# EAGLE design untitled (EAGLE 9.3.0)
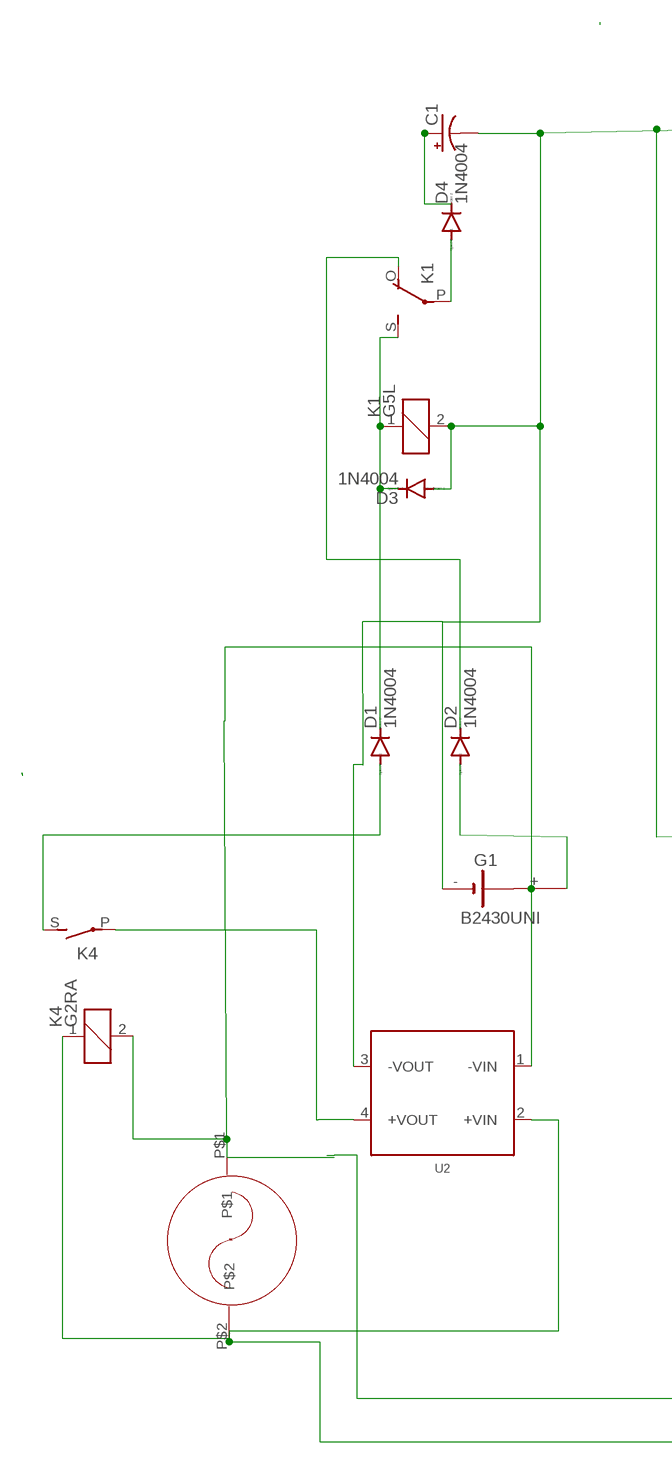
[diagram p0: schematic, sheet 1, part 1 of 2]
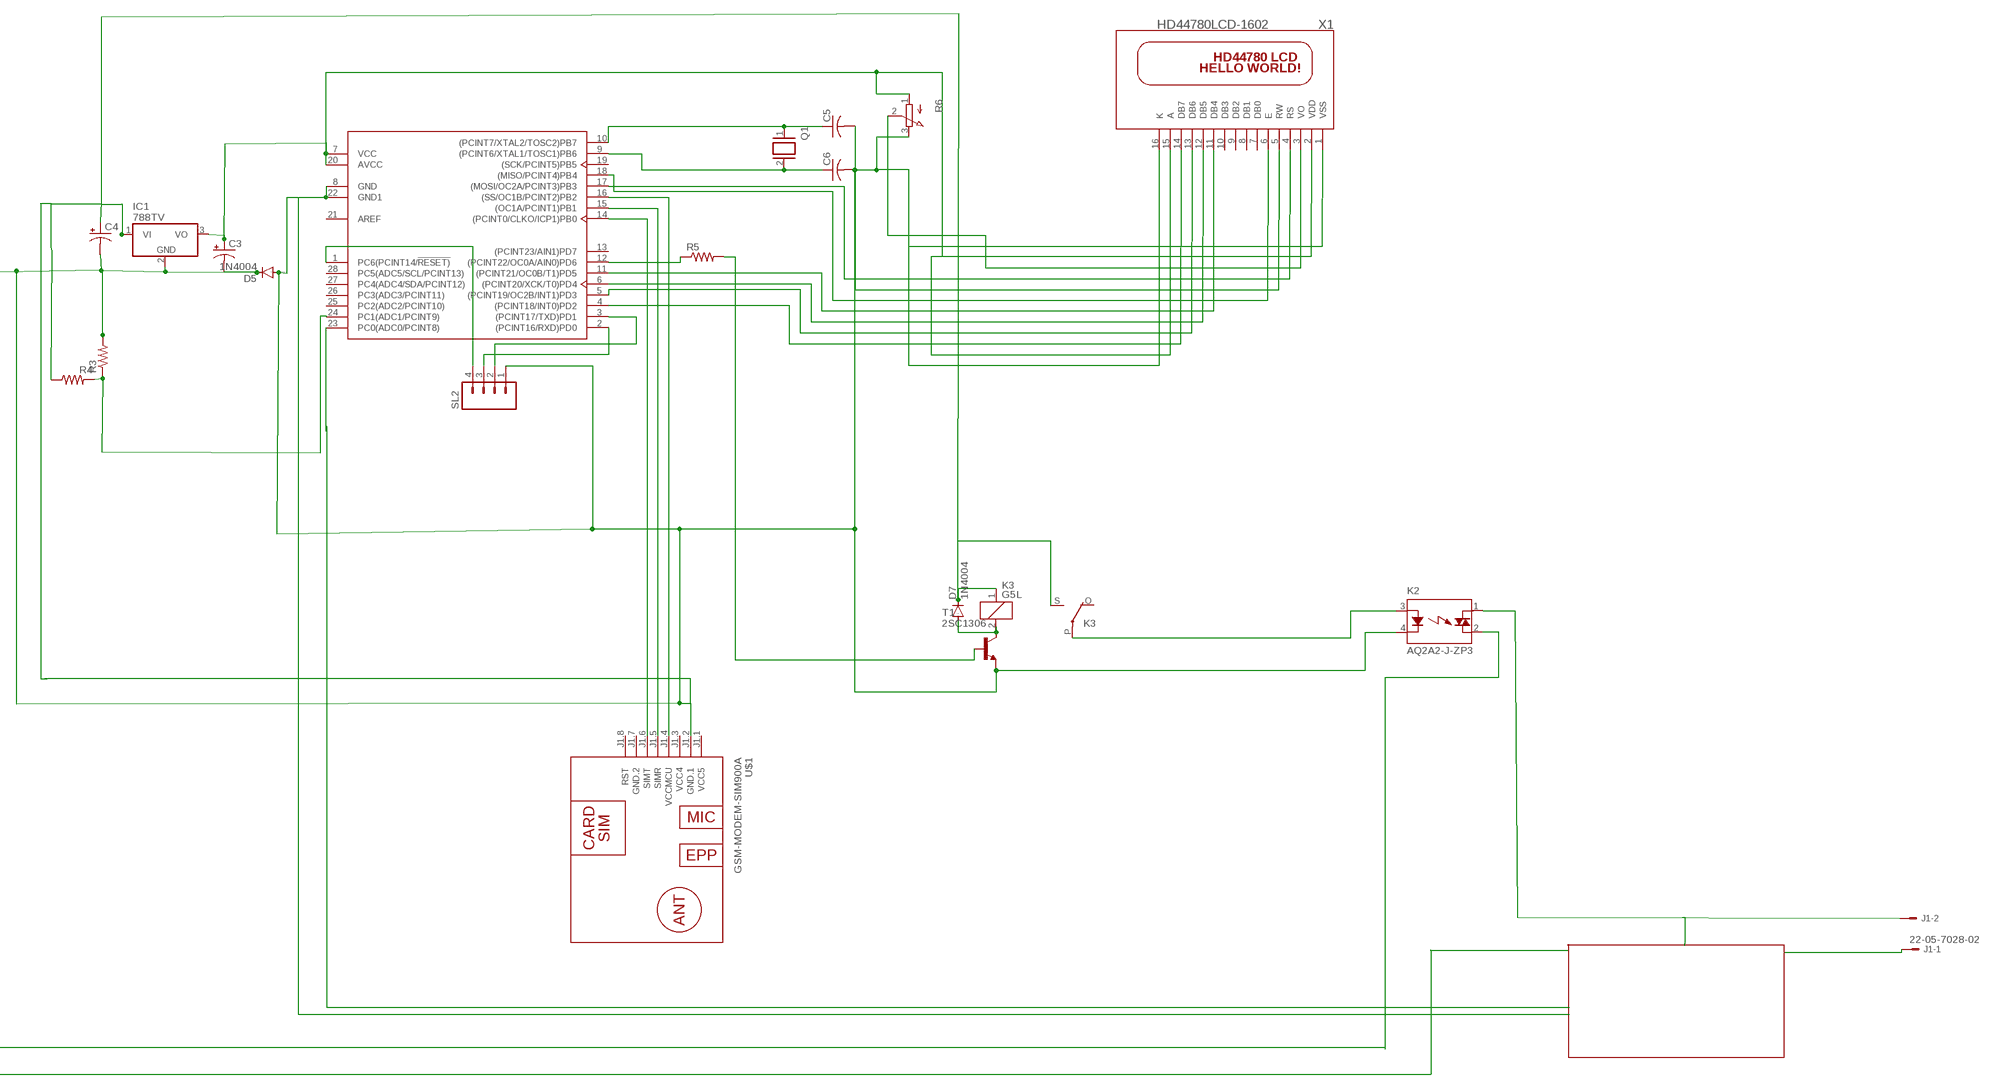
[diagram p1: schematic, sheet 1, part 2 of 2]

## Parts
C1  CPOL-USE10-20  [EB20D]
C3  CPOL-USE2-5  [E2-5]
C4  CPOL-USE5-8.5  [E5-8,5]
C5  C-US025-025X050  [C025-025X050]
C6  C-US025-025X050  [C025-025X050]
D1  1N4004  [DO41-10]
D2  1N4004  [DO41-10]
D3  1N4004  [DO41-10]
D4  1N4004  [DO41-10]
D5  1N4004  [DO41-10]
D7  1N4004  [DO41-10]
G1  B2430UNI  [B2430UNI]
IC1  788TV  [TO220V]
J1  22-05-7028-02  [7395-02]
K1  G5L  [G5LE]
K2  AQ2A2-J-ZP3  [AQ1-FLAT]
K3  G5L  [G5LE]
K4  G2RA  [G2RA]
Q1  XTAL  [Q]
R3  R-US_0207/7  [0207/7]
R4  R-US_0207/7  [0207/7]
R5  R-US_0207/7  [0207/7]
R6  3RP/1610N  [3RP/1610N]
SL2  M04  [04P]
T1  2SC1306  [TO220BV]
U1  ATMEGA328P-PU  [DIP-28]
U2  MAGI³C-FISM_SIP-4_177920501  [MAGI³C-FISM_SIP-4]
U$1  GSM-MODEM-SIM900A  [GSM-MODEM-SIM900A]
U$2  AC230.  [AC230]  (not placed on a sheet)
U$3  AC230.  [AC230]  (not placed on a sheet)
U$4  AC230.  [AC230]  (not placed on a sheet)
U$5  AC230.  [AC230]  (not placed on a sheet)
U$6  AC230.  [AC230]  (not placed on a sheet)
U$7  AC230.  [AC230]  (not placed on a sheet)
U$8  AC230.  [AC230]  (not placed on a sheet)
U$9  AC230.  [AC230]  (not placed on a sheet)
U$10  AC230.  [AC230]  (not placed on a sheet)
U$11  AC230.  [AC230]  (not placed on a sheet)
U$12  AC230.  [AC230]  (not placed on a sheet)
U$13  AC230.  [AC230]
X1  HD44780LCD-1602  [LCD1602]

## Nets
N$1: D1.A K4.S(2:S)
N$2: C4.+
N$3: D2.A G1.+
N$4: D2.C K1.O(2:O)
N$5: D1.C D3.C K1.1 K1.S(2:S)
N$6: D4.A K1.P(2:P)
N$7: R5.1 U1.12((PCINT22/OC0A/AIN0)PD6)
N$8: C1.- C3.- C4.- D3.A D5.C G1.- IC1.2(GND) K1.2
N$9: U2.3(-VOUT)
N$10: C6.1 Q1.2 U1.9((PCINT6/XTAL1/TOSC1)PB6)
N$11: C5.1 Q1.1 U1.10((PCINT7/XTAL2/TOSC2)PB7)
N$12: G1.+@2(+) K4.2 U2.1(-VIN) U$13.P$1
N$13: K2.2(DS2)
N$14: U1.11((PCINT21/OC0B/T1)PD5) X1.11(DB4)
N$15: R6.2(S) X1.3(VO)
N$16: U1.17((MOSI/OC2A/PCINT3)PB3) X1.4(RS)
N$17: U1.18((MISO/PCINT4)PB4) X1.6(E)
N$18: U1.6((PCINT20/XCK/T0)PD4) X1.12(DB5)
N$19: U1.5((PCINT19/OC2B/INT1)PD3) X1.13(DB6)
N$20: U1.4((PCINT18/INT0)PD2) X1.14(DB7)
N$21: U1.23(PC0(ADC0/PCINT8))
N$22: K3.S(2:S)
N$23: K2.3(A) K3.P(2:P)
N$24: R3.1 R4.2 U1.24(PC1(ADC1/PCINT9))
N$26: J1.2 K2.1(DS1)
N$28: J1.1
N$31: R5.2 T1.1(B)
N$32: D7.A K3.2 T1.2(C)
N$33: SL2.4 U1.1(PC6(PCINT14/!RESET))
N$34: SL2.3 U1.2((PCINT16/RXD)PD0)
N$35: SL2.2 U1.3((PCINT17/TXD)PD1)
N$36: U1.14((PCINT0/CLKO/ICP1)PB0) U$1.J1.6(SIMT)
N$37: U1.15((OC1A/PCINT1)PB1) U$1.J1.5(SIMR)
N$38: U1.16((SS/OC1B/PCINT2)PB2) U$1.J1.4(VCCMCU)
N$40: IC1.1(VI)
N$42: R3.2
N$150: D7.C K3.1
N$152: C1.+ D4.C
N$154: R4.1
N$158: K4.P(2:P) U2.4(+VOUT)
N$159: K4.1 U2.2(+VIN) U$13.P$2
VDD: C3.+ IC1.3(VO) R6.1(A) U1.7(VCC) U1.20(AVCC) X1.2(VDD) X1.15(A)
VSS: C5.2 C6.2 D5.A K2.4(K) R6.3(E) SL2.1 T1.3(E) U1.8(GND) U1.22(GND1) U$1.J1.2(GND.1) X1.1(VSS) X1.5(RW) X1.16(K)
Unconnected: G1.+@1(+) G1.+@3(+) G1.+@4(+) G1.-@1(-) K3.O(2:O) U1.13((PCINT23/AIN1)PD7) U1.19((SCK/PCINT5)PB5) U1.21(AREF) U1.25(PC2(ADC2/PCINT10)) U1.26(PC3(ADC3/PCINT11)) U1.27(PC4(ADC4/SDA/PCINT12)) U1.28(PC5(ADC5/SCL/PCINT13)) U$1.J1.8(RST) U$2.P$1 U$2.P$2 U$3.P$1 U$3.P$2 U$4.P$1 U$4.P$2 U$5.P$1 U$5.P$2 U$6.P$1 U$6.P$2 U$7.P$1 U$7.P$2 U$8.P$1 U$8.P$2 U$9.P$1 U$9.P$2 U$10.P$1 U$10.P$2 U$11.P$1 U$11.P$2 U$12.P$1 U$12.P$2 X1.7(DB0) X1.8(DB1) X1.9(DB2) X1.10(DB3)

## Power pins joined to a net without a drawn wire
GND.2: U$1.J1.7(GND.2)
VCC4: U$1.J1.3(VCC4)
VCC5: U$1.J1.1(VCC5)

## Library data of the parts
C1 C3 C4 = adafruit:CPOL-US: POLARIZED CAPACITOR, American symbol
C5 C6 = adafruit:C-US: CAPACITOR, American symbol
D1-D5 D7 = diode:1N4004: DIODE general purpose rectifier, 1 A
G1 = battery:B2430UNI: LI BATTERY
IC1 = linear:78*: Positive VOLTAGE REGULATOR Source: http://cache.national.com/ds/LM/LM78L05.pdf http://www.fairchildsemi.com/ds/LM/LM7805.pdf
J1 = con-molex:22-?-02: CONNECTOR wire to board 2.54 mm (.1 inch) pitch header; MF: MOLEX; OC_FARNELL: 9731601; OC_NEWARK: unknown
K1 K3 = relay:G5L: RELAY 1 x switch, 10 A/120 V AC, 8 A/30 V ADC, Omron; OC_FARNELL: unknown; OC_NEWARK: unknown
K2 = relay:AQ?: SOLID STATE RELAY NAiS Source: http://www.mew-europe.com/.. en_ds_61601_0000.pdf; MPN: AQ2A2-ZP3/28VDC; OC_FARNELL: 1163552; OC_NEWARK: 13P1232
K4 = relay:G2RA: RELAY 1 x norm. open, Omron; OC_FARNELL: unknown; OC_NEWARK: unknown
Q1 = special:XTAL: CRYSTAL
R3-R5 = adafruit:R-US_: RESISTOR, American symbol
R6 = pot:3RP/1610N: 16mm Potentiometer one level Source: http://www.alphapotentiometers.net/html/16mm_pot_2.html
SL2 = con-amp-quick:M04: AMP QUICK CONNECTOR; OC_FARNELL: unknown; OC_NEWARK: unknown
T1 = transistor:2SC1306: NPN Transistor Final RF Power Outupt Source: 2sc1306.pdf
U1 = Microcontroller:ATMEGA328P-PU: IC MCU 8BIT 32KB FLASH 28DIP Manufacturer's datasheet <http://ww1.microchip.com/downloads/en/DeviceDoc/ATmega48A-PA-88A-PA-168A-PA-328-P-DS-DS40002061A.pdf>; CREATED_BY: PCBLayout.com; DIGIKEY_PART_NUMBER: ATMEGA328P-PU-ND; MANUFACTURER: Microchip Technology; MPN: ATMEGA328P-PU; PACKAGE: DIP-28
U2 = Wurth_Isolated Converter_MagI³C-FISM:MAGI³C-FISM_SIP-4: MagI³C-FISM Fixed Isolated Module Characteristics Simplest design (no transformer design know how required) Leaded through-hole package for easy manufacturing and prototyping Stand alone solution (CIN and COUT integrated, no external components) Simple functional isolation for overvoltage protection, avoiding ground loops, ground shift and noise in signal path or sensor systems Industrial standard package and pin configuration Low conducted and radiated EMI (compliant to EN55022 class B) UL60950 certified Applications Data acquisition Test and measurement systems Interface and microcontroller supply Industrial control <https://katalog.we-online.com/media/images/v2/o84919v209%20Family_WE-FISM.jpg> Details see: https://katalog.we-online.com/en/pm/MAGIC-FISM Updated by Ella, Wu 2019-09-19 2019 (C) Wurth Elektronik; DATASHEET-URL: https://katalog.we-online.com/pm/datasheet/177920501.pdf; MOUNT: THT; PART-NUMBER: 177920501; V-INPUT: 2.97-3.63V; V-OUTPUT: 5V; VISO: 1kV; W-OUTPUT: 1W
U$1 = diy-modules:GSM-MODEM-SIM900A: GSM Mini Module based on SIM900A Schematic available here: http://www.electrodragon.com/w/SIM900_(SIM900A)_Mini_DEV_Board
U$2-U$13 = AC230:AC230.
X1 = adafruit:HD44780LCD: HD44780 LCD Standard character type LCDs, available in sizes from 8x1 to 40x4!

## Board
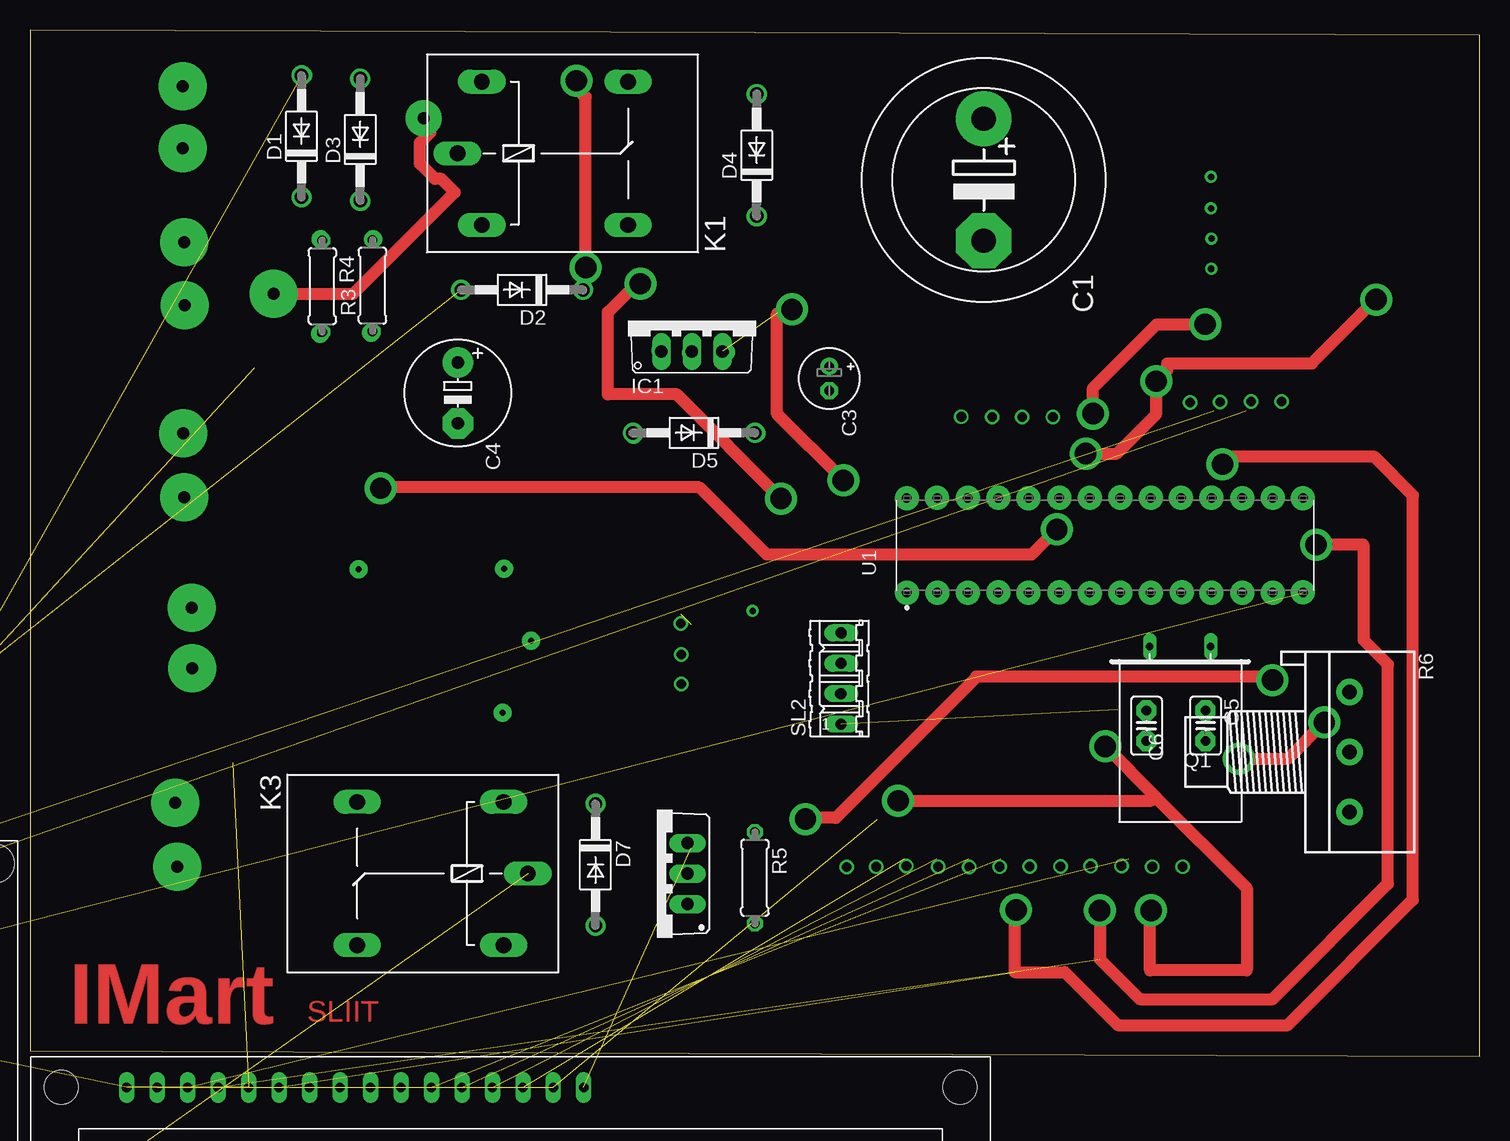
[diagram p2: board, top side]
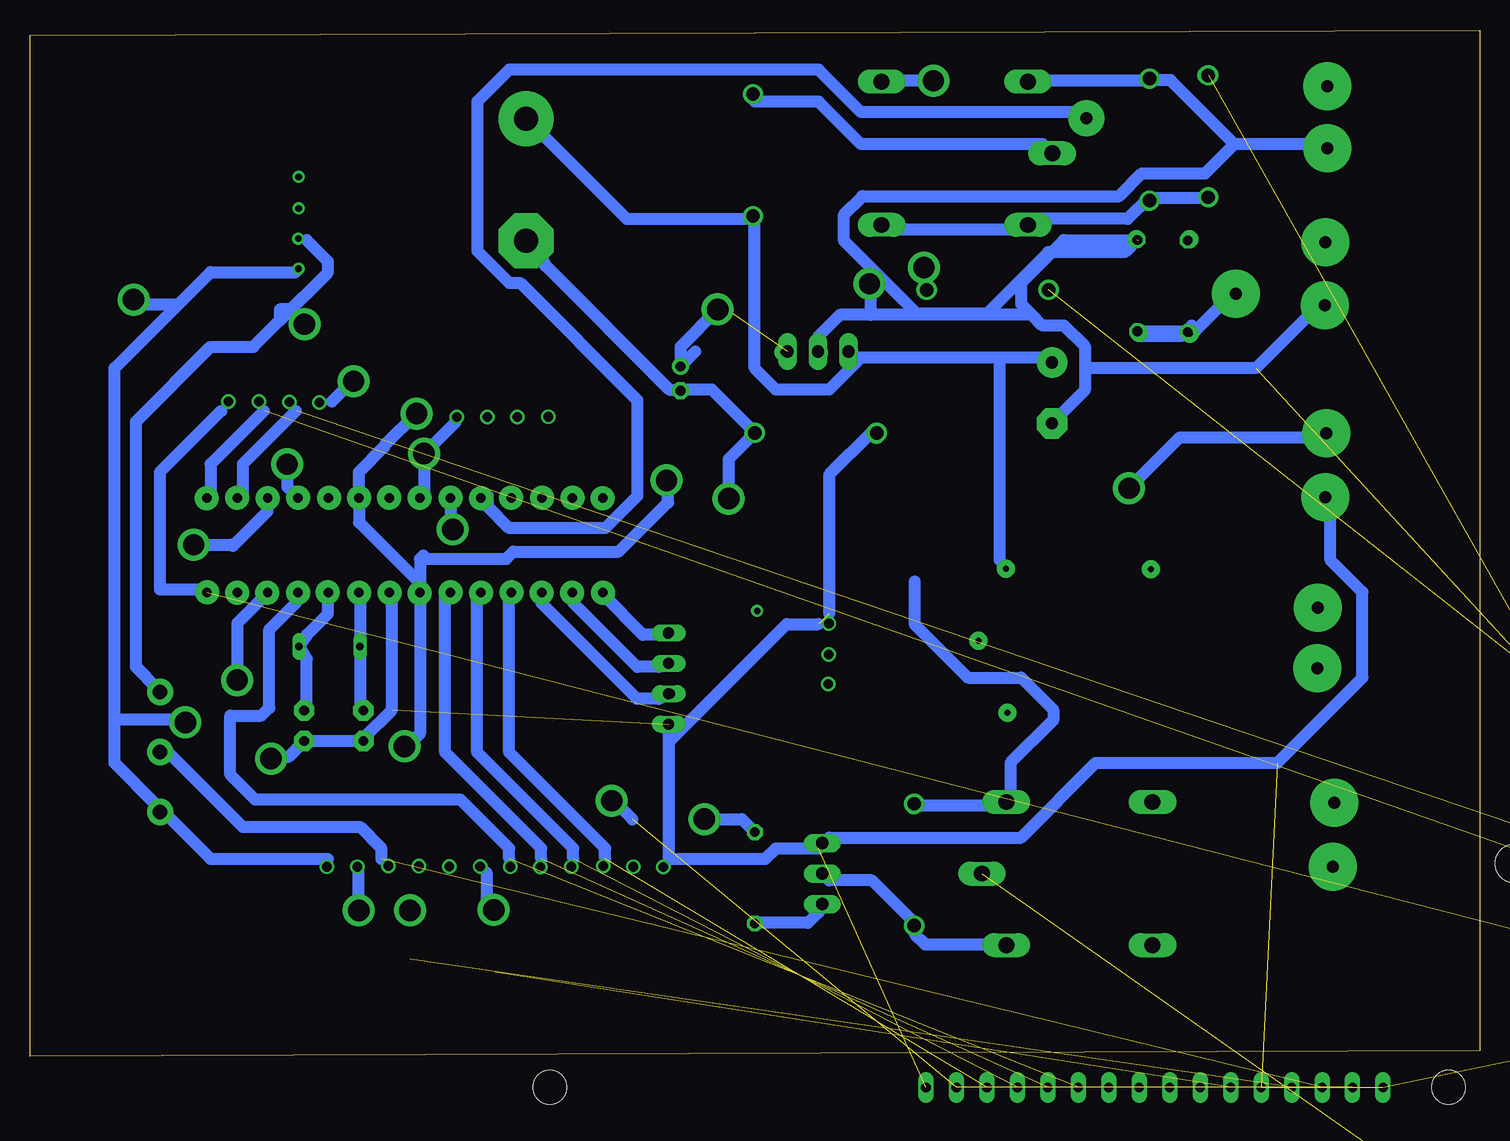
[diagram p3: board, bottom side, seen from below]

Size 120.85 x 85.51 mm. Coordinates in mm from the lower left corner, seen from the top.
Outline: 0,0.43 120.85,0 120.85,85.08 0,85.51 0,0.43
Copper layers (1*16): Top 0.035mm / dielectric 1.5mm / Bottom 0.035mm
Design rules "default *": minimum track width 40mil, minimum drill 0.35mm, track to track 30mil, track to pad 25mil, pad to pad 25mil, via to via 25mil, smd to smd 6mil, copper to edge 40mil, drill to drill 15mil, minimum pad ring 10mil, minimum via ring 8mil, stop-mask expansion 4mil, vias tented up to drill 0mil, thermal gap 10mil

### Footprints (pad centres in the part's own frame; a part is rotated, then mirrored left to right if it is on the bottom)
EB20D = drill 2.007 pad 4.597: + -5.08,0 | drill 2.007 pad 4.597 octagon: - 5.08,0
E2-5 = drill 0.813 pad 1.422: + -1.016,0 | drill 0.813 pad 1.422 octagon: - 1.016,0
E5-8,5 = drill 1.016 pad 2.54: + -2.54,0 | drill 1.016 pad 2.54 octagon: - 2.54,0
C025-025X050 = drill 0.813 pad 1.676 octagon: 1 -1.27,0; 2 1.27,0
DO41-10 = drill 1.118: A 5.08,0; C -5.08,0
B2430UNI = drill 1.118 pad 2.54 octagon: + 3.81,14.605; +@1 -3.81,14.605; +@2 -5.08,12.065; +@3 5.08,12.065; - 0,-5.715; -@1 0,-8.255 | drill 1.803 pad 3.81 octagon: +@4 0,12.065
TO220V = drill 1.016 long: 1 -2.54,-2.54; 2 0,-2.54; 3 2.54,-2.54
7395-02 = drill 1.016 long: 1 1.27,0; 2 -1.27,0
G5LE = drill 1.321 long: 1 -7.493,-5.969; 2 -7.493,5.969; O 4.699,5.969; P -9.525,0; S 4.699,-5.969
AQ1-FLAT = drill 1.2: 1 -12.7,-6.35; 2 -12.7,6.35; 3 12.7,5.08; 4 12.7,-5.08
G2RA = drill 1.321 long: 1 -3.81,-3.683; 2 -3.81,3.81; P 16.18,3.81; S 19.685,-3.683
Q = drill 0.61 long: 1 -2.54,-7.62; 2 2.54,-7.62
0207/7 = drill 0.813 octagon: 1 -3.81,0; 2 3.81,0
3RP/1610N = drill 1.2 pad 2.184: 1 -5,0; 2 0,0; 3 5,0
04P = drill 0.914 long: 1 -3.81,0; 2 -1.27,0; 3 1.27,0; 4 3.81,0
TO220BV = drill 1.016 long: 1 -2.54,-2.54; 2 0,-2.54; 3 2.54,-2.54
DIP-28 = drill 0.79 pad 1.19 square: 1 -16.51,-3.95 | drill 0.79 pad 1.19: 2 -13.97,-3.95; 3 -11.43,-3.95; 4 -8.89,-3.95; 5 -6.35,-3.95; 6 -3.81,-3.95; 7 -1.27,-3.95; 8 1.27,-3.95; 9 3.81,-3.95; 10 6.35,-3.95; 11 8.89,-3.95; 12 11.43,-3.95; 13 13.97,-3.95; 14 16.51,-3.95; 15 16.51,3.95; 16 13.97,3.95; 17 11.43,3.95; 18 8.89,3.95; 19 6.35,3.95; 20 3.81,3.95; 21 1.27,3.95; 22 -1.27,3.95; 23 -3.81,3.95; 24 -6.35,3.95; 25 -8.89,3.95; 26 -11.43,3.95; 27 -13.97,3.95; 28 -16.51,3.95
MAGI³C-FISM_SIP-4 = drill 1: 1 -3.81,0; 2 -1.27,0; 3 1.27,0; 4 3.81,0
GSM-MODEM-SIM900A = drill 1 square: J1.1 -22.86,20.32 | drill 1: J1.2 -22.86,17.78; J1.3 -22.86,15.24; J1.4 -22.86,12.7; J1.5 -22.86,10.16; J1.6 -22.86,7.62; J1.7 -22.86,5.08; J1.8 -22.86,2.54 | hole 3.2: -22.225,24.765; 22.225,24.765; 22.225,-23.495
AC230 = drill 0.6 square: P$1 0,2.54; P$2 0,-2.54
LCD1602 = drill 0.8 long: 1 8,33.46; 2 10.54,33.46; 3 13.08,33.46; 4 15.62,33.46; 5 18.16,33.46; 6 20.7,33.46; 7 23.24,33.46; 8 25.78,33.46; 9 28.32,33.46; 10 30.86,33.46; 11 33.4,33.46; 12 35.94,33.46; 13 38.48,33.46; 14 41.02,33.46; 15 43.56,33.46; 16 46.1,33.46 | hole 2.8: 2.54,2.54; 2.54,33.46; 77.46,33.46; 77.46,2.54

### Placement (x,y rotation side)
C1  79.5,73.02 270 top
C3  66.62,56.46 270 top
C4  35.66,55.27 270 top
C5  97.99,27.53 270 top
C6  93.07,27.53 270 top
D1  22.63,76.66 90 top
D2  41.02,63.86 180 top
D3  27.53,76.38 90 top
D4  60.58,75.08 90 top
D5  55.35,51.94 180 top
D7  47.14,15.95 270 top
G1  -62.23,-24.97 0 top  (outside the outline)
IC1  55.17,61.26 0 top
J1  -100.33,-42.75 0 top  (outside the outline)
K1  45.16,75.23 0 top
K2  -86.36,-70.69 0 top  (outside the outline)
K3  31.98,15.21 180 top
K4  -96.52,-91.01 0 top  (outside the outline)
Q1  95.89,26.52 180 top
R3  28.55,64.21 90 top
R4  24.36,64.16 270 top
R5  60.43,14.86 270 top
R6  110.01,25.35 270 top
SL2  67.61,31.47 90 top
T1  52.27,15.21 90 top
U1  89.61,42.57 0 top
U2  -87.63,-45.29 0 top  (outside the outline)
U$1  -25.15,-8.72 0 top
U$2  -74.9,0.43 0 top  (outside the outline)
U$3  -76.57,0.43 0 top  (outside the outline)
U$4  -78.24,0.43 0 top  (outside the outline)
U$5  -79.91,0.43 0 top  (outside the outline)
U$6  -81.59,0.43 0 top  (outside the outline)
U$7  -83.26,0.43 0 top  (outside the outline)
U$8  -84.93,0.43 0 top  (outside the outline)
U$9  -86.6,0.43 0 top  (outside the outline)
U$10  -88.27,0.43 0 top  (outside the outline)
U$11  -89.94,0.43 0 top  (outside the outline)
U$12  -91.62,0.43 0 top  (outside the outline)
U$13  -93.98,-33.86 0 top  (outside the outline)
X1  0.06,-36.06 0 top

### Tracks (layer width: path | path; a pad name or v marks a point on that pad's centre or on a via)
N$1  (1 unrouted)
N$2
  Bottom 1.016: 40.01,58.22 36.45,58.22 C4.+ | 40.01,58.22 51.56,58.22 | 51.56,58.22 52.45,58.22 | 40.01,41.33 40.01,58.22 | 60.45,69.77 60.45,57.33 58.67,55.55 54.23,55.55 51.56,58.22
N$3  (1 unrouted)
N$4  (via drill 1.78 pad 0.38)
  Top 1.016: v46.33,65.71 46.33,79.91 45.01,81.23 45.49,81.23 v45.54,81.28
  Bottom 1.016: D2.C 46.18,63.93 46.18,65.48 46.33,65.63 v46.33,65.71 | v45.54,81.28 49.78,81.28 K1.O
N$5
  Bottom 1.016: 27.56,71.55 23.11,71.55 D1.C | 27.56,71.55 29.34,69.77 37.34,69.77 K1.1 38.23,68.88 49.78,68.88 K1.S | 27.56,71.55 D3.C
N$6
  Bottom 1.016: D4.A 60.45,79.55 55.12,79.55 51.56,76 36.45,76 K1.P
N$7  (via drill 1.78 pad 0.38)
  Top 1.016: v103.58,31.34 103.3,31.62 78.89,31.62 78.92,31.6 67.18,19.86 65.08,19.86 64.97,19.76 v64.64,19.76
  Bottom 1.016: U1.12 103.58,36.08 v103.58,31.34 | v64.64,19.76 61.52,19.76 R5.1
N$8  (via drill 1.78 pad 0.38)  (2 unrouted)
  Top 1.016: v62.61,46.46 53.92,55.14 48.18,55.14 48.18,62 50.55,64.36 v50.88,64.36
  Bottom 1.016: 66.67,55.55 64.01,55.55 60.45,51.99 D5.C 62.61,49.76 v62.61,46.46 | 66.67,55.55 67.56,55.55 77.92,65.9 78.3,66.74 C1.- | 66.67,55.55 C3.- | 28.45,68 34.67,68 38.23,64.44 38.23,62.66 37.34,61.77 | 37.34,61.77 36.45,60.88 34.67,60.88 32.89,59.11 32.89,57.33 | 32.89,57.33 32.89,55.55 35.56,52.88 C4.- | 37.34,61.77 50.77,61.77 | 50.77,61.77 53.34,61.77 55.12,59.99 55.12,59.11 IC1.2 | 27.56,81.33 37.34,81.33 K1.2 | 27.56,81.33 25.78,81.33 20.45,76 | 13.34,76 20.45,76 | 27.56,81.33 D3.A | 32.89,57.33 18.67,57.33 13.34,62.66 | v50.88,64.36 50.77,64.26 50.77,61.77 | 20.45,76 22.89,73.56 28.16,73.56 30.05,71.67 51.47,71.67 52.98,70.15 52.98,67.94 46.92,61.87 41.1,61.87 35.98,67 29.59,67 28.57,68.02
N$10
  Bottom 1.016: U1.9 93.34,38.66 Q1.2 93.34,28.98 C6.1
N$11
  Bottom 1.016: C5.1 97.79,29.28 97.79,33.08 Q1.1 97.77,35.13 96.01,36.88 96.01,38.66 U1.10
N$12  (3 unrouted)
N$14  (1 unrouted)
  Bottom 1.016: 80.9,16.43 80.9,17.32 84.96,21.39 102.08,21.39 104.17,23.47 104.17,28.37 101.58,28.37 100.91,29.03 100.91,35.53 98.68,37.77 98.68,38.66 U1.11
N$15  (1 unrouted)
  Bottom 1.016: 91.57,16.43 91.57,17.32 93.34,19.1 103.12,19.1 109.35,25.32 R6.2
N$16  (via drill 1.78 pad 0.38)  (1 unrouted)
  Top 1.016: v89.18,12.14 89.18,8.08 92.51,4.75 103.61,4.75 113.21,14.35 113.21,32.64 111.18,34.67 111.18,42.57 111.12,42.62 v107.21,42.62
  Bottom 1.016: 88.42,12.65 89.18,11.89 v89.18,12.14 | v107.21,42.62 104.06,42.62 103.94,42.49 101.04,45.39 U1.17
N$17  (via drill 1.78 pad 0.38)  (1 unrouted)
  Top 1.016: v82.19,12.19 82.07,12.06 82.07,7.01 86.26,7.01 90.68,2.59 104.85,2.59 115.29,13.03 115.29,46.74 112.09,49.94 99.39,49.94 99.26,49.81 99.26,49.48 v99.42,49.33
  Bottom 1.016: 82.8,15.32 82.8,12.93 82.19,12.32 v82.19,12.19 | v99.42,49.33 99.42,47.43 U1.18
N$18  (1 unrouted)
  Bottom 1.016: 78.23,16.43 78.23,17.32 86.23,25.32 86.23,38.66 U1.6
N$19  (1 unrouted)
  Bottom 1.016: 75.56,16.43 75.56,17.32 83.57,25.32 83.57,38.66 U1.5
N$20  (1 unrouted)
  Bottom 1.016: 72.9,16.43 72.9,17.32 80.9,25.32 80.9,38.66 U1.4
N$21  (via drill 1.78 pad 0.38)
  Top 1.016: v85.61,43.9 83.5,41.78 61.42,41.78 55.8,47.4 29.31,47.4 v29.23,47.32
  Bottom 1.016: U1.23 85.8,44.45 85.61,44.26 v85.61,43.9 | v29.23,47.32 24.99,51.56 12.52,51.56 12.39,51.56
N$23  (1 unrouted)
N$24  (via drill 1 pad 3, 1 pad 4)
  Top 1.016: v20.31,63.51 26.93,63.51 35.4,71.98 34.28,73.1 33.76,73.1 32.51,74.35 32.51,76.12 33.38,76.99 33.38,78.31 32.95,78.31 v32.81,78.17
  Bottom 1.016: U1.24 82.68,46.66 82.68,45.77 80.9,43.99 72.9,43.99 70.23,46.66 70.23,54.66 80.01,64.44 80.9,64.44 83.57,67.11 83.57,79.55 80.9,82.22 55.12,82.22 51.56,78.66 33.3,78.66 v32.81,78.17 | 24,60.88 R4.2 24.89,59.99 28.45,59.99 R3.1 23.74,60.4 20.63,63.51 v20.31,63.51
N$26  (1 unrouted)
N$31
  Bottom 1.016: R5.2 60.45,11.1 56.01,11.1 55.12,11.99 T1.1
N$32
  Bottom 1.016: T1.2 54.23,14.66 50.67,14.66 47.12,11.1 D7.A 47.12,10.21 46.23,9.32 40.01,9.32 K3.2
N$33
  Bottom 1.016: U1.1 73.1,38.43 69.77,35.1 68.45,35.1 SL2.4
N$34
  Bottom 1.016: U1.2 75.56,38.66 75.56,37.77 70.23,32.44 68.45,32.44 SL2.3
N$35
  Bottom 1.016: U1.3 78.23,38.66 78.23,37.77 70.23,29.77 68.45,29.77 SL2.2
N$36  (1 unrouted)
  Bottom 1.016: 104.9,53.77 110.03,48.64 110.03,38.89 106.39,38.89 U1.14
N$37  (1 unrouted)
  Bottom 1.016: 101.35,53.77 105.79,49.33 105.79,46.66 U1.15
N$38  (1 unrouted)
  Bottom 1.016: 98.68,53.77 103.12,49.33 103.12,46.66 U1.16
N$39  (via drill 0.55 pad 2)
  other vias: 106.09,38.64
N$43  (via drill 0.8 pad 1.1)
  other vias: 96.09,15.78
N$44  (via drill 0.8 pad 1.1)
  other vias: 93.56,15.78
N$45  (via drill 0.8 pad 1.1)
  other vias: 90.98,15.86
N$46  (via drill 0.8 pad 1.1)
  other vias: 88.43,15.83
N$47  (via drill 0.8 pad 1.1)
  other vias: 85.9,15.81
N$48  (via drill 0.8 pad 1.1)
  other vias: 83.33,15.8
N$49  (via drill 0.8 pad 1.1)
  other vias: 80.82,15.78
N$50  (via drill 0.8 pad 1.1)
  other vias: 78.31,15.77
N$51  (via drill 0.8 pad 1.1)
  other vias: 75.72,15.78
N$52  (via drill 0.8 pad 1.1)
  other vias: 73.06,15.83
N$53  (via drill 0.8 pad 1.1)
  other vias: 70.55,15.78
N$54  (via drill 0.8 pad 1.1)
  other vias: 68.07,15.76
N$55  (via drill 0.8 pad 1.1)
  other vias: 67.67,27.62
N$56  (via drill 0.8 pad 1.1)
  other vias: 67.5,30.2
N$57  (via drill 0.8 pad 1.1)
  other vias: 67.62,32.68
N$58  (via drill 0.8 pad 1.1)
  other vias: 67.67,35.18
N$59  (via drill 0.8 pad 1.1)
  other vias: 54.82,17.69
N$60  (via drill 0.8 pad 1.1)
  other vias: 54.84,15.16
N$61  (via drill 0.8 pad 1.1)
  other vias: 54.88,12.62
N$62  (via drill 0.8 pad 1.1)
  other vias: 54.31,31.01
N$63  (via drill 0.8 pad 1.1)
  other vias: 54.29,33.47
N$64  (via drill 0.8 pad 1.1)
  other vias: 54.25,36.05
N$65  (via drill 0.8 pad 1.1)
  other vias: 77.64,53.28
N$66  (via drill 0.8 pad 1.1)
  other vias: 80.21,53.28
N$67  (via drill 0.8 pad 1.1)
  other vias: 82.72,53.25
N$68  (via drill 0.8 pad 1.1)
  other vias: 85.27,53.25
N$69  (via drill 0.8 pad 1.1)
  other vias: 96.72,54.48
N$70  (via drill 0.8 pad 1.1)
  other vias: 99.21,54.52
N$71  (via drill 0.8 pad 1.1)
  other vias: 101.78,54.54
N$72  (via drill 0.8 pad 1.1)
  other vias: 104.32,54.54
N$73  (via drill 0.55 pad 2)
  other vias: 106.12,46.51
N$74  (via drill 0.55 pad 2)
  other vias: 103.59,46.53
N$75  (via drill 0.55 pad 2)
  other vias: 101.05,46.51
N$76  (via drill 0.55 pad 2)
  other vias: 98.5,46.52
N$77  (via drill 0.55 pad 2)
  other vias: 95.92,46.55
N$78  (via drill 0.55 pad 2)
  other vias: 93.42,46.51
N$79  (via drill 0.55 pad 2)
  other vias: 90.9,46.57
N$80  (via drill 0.55 pad 2)
  other vias: 90.92,46.54
N$81  (via drill 0.55 pad 2)
  other vias: 88.36,46.52
N$82  (via drill 0.55 pad 2)
  other vias: 85.81,46.55
N$83  (via drill 0.55 pad 2)
  other vias: 83.25,46.49
N$84  (via drill 0.55 pad 2)
  other vias: 80.73,46.54
N$85  (via drill 0.55 pad 2)
  other vias: 78.18,46.52
N$86  (via drill 0.55 pad 2)
  other vias: 75.62,46.51
N$87  (via drill 0.55 pad 2)
  other vias: 73.1,46.51
N$88  (via drill 0.55 pad 2)
  other vias: 73.1,38.62
N$89  (via drill 0.55 pad 2)
  other vias: 75.65,38.61
N$90  (via drill 0.55 pad 2)
  other vias: 78.2,38.63
N$91  (via drill 0.55 pad 2)
  other vias: 80.72,38.65
N$92  (via drill 0.55 pad 2)
  other vias: 83.23,38.63
N$93  (via drill 0.55 pad 2)
  other vias: 85.79,38.64
N$94  (via drill 0.55 pad 2)
  other vias: 88.36,38.58
N$95  (via drill 0.55 pad 2)
  other vias: 90.89,38.6
N$96  (via drill 0.55 pad 2)
  other vias: 93.42,38.62
N$97  (via drill 0.55 pad 2)
  other vias: 96.03,38.66
N$98  (via drill 0.55 pad 2)
  other vias: 98.49,38.63
N$99  (via drill 0.55 pad 2)
  other vias: 101.07,38.62
N$100  (via drill 0.55 pad 2)
  other vias: 103.59,38.63
N$101  (via drill 0.55 pad 1)
  other vias: 98.46,73.27
N$102  (via drill 0.55 pad 1)
  other vias: 98.46,70.65
N$103  (via drill 0.55 pad 1)
  other vias: 98.49,68.12
N$104  (via drill 0.55 pad 1)
  other vias: 98.47,65.61
N$105  (via drill 0.55 pad 1)
  other vias: 60.24,37.1
N$106  (via drill 1 pad 4)
  other vias: 12.71,80.84
N$107  (via drill 1 pad 4)
  other vias: 12.71,75.67
N$108  (via drill 1 pad 4)
  other vias: 12.86,67.84
N$109  (via drill 1 pad 4)
  other vias: 12.92,62.56
N$110  (via drill 1 pad 4)
  other vias: 12.78,51.9
N$111  (via drill 1 pad 4)
  other vias: 12.86,46.57
N$112  (via drill 1 pad 4)
  other vias: 13.49,37.36
N$113  (via drill 1 pad 4)
  other vias: 13.54,32.31
N$114  (via drill 1 pad 4)
  other vias: 12.12,21.1
N$115  (via drill 1 pad 4)
  other vias: 12.26,15.77
N$116  (via drill 0.5 pad 1.5)
  other vias: 22.78,81.73
N$117  (via drill 0.5 pad 1.5)
  other vias: 22.63,71.49
N$118  (via drill 0.5 pad 1.5)
  other vias: 27.62,71.19
N$119  (via drill 0.5 pad 1.5)
  other vias: 32.76,78.03
N$120  (via drill 0.5 pad 1.5)
  other vias: 37.71,81.13
N$121  (via drill 0.5 pad 1.5)
  other vias: 27.47,81.53
N$122  (via drill 0.5 pad 1.5)
  other vias: 50.05,81.28
N$123  (via drill 0.5 pad 1.5)
  other vias: 49.75,69.34
N$124  (via drill 0.5 pad 1.5)
  other vias: 37.46,69.29
N$125  (via drill 0.5 pad 1.5)
  other vias: 35.61,57.65
N$126  (via drill 0.5 pad 1.5)
  other vias: 35.81,52.75
N$127  (via drill 0.5 pad 1.5)
  other vias: 28.42,60.29
N$128  (via drill 0.5 pad 1.5)
  other vias: 24.17,60.19
N$129  (via drill 0.5 pad 1.5)
  other vias: 24.22,68.09
N$130  (via drill 0.5 pad 1.5)
  other vias: 28.62,68.09
N$131  (via drill 0.5 pad 1.5)
  other vias: 27.4,40.56
N$132  (via drill 0.5 pad 1.5)
  other vias: 39.5,40.62
N$133  (via drill 0.5 pad 1.5)
  other vias: 41.78,34.62
N$134  (via drill 0.5 pad 1.5)
  other vias: 39.39,28.62
N$135  (via drill 0.5 pad 1.5)
  other vias: 39.41,21.22
N$136  (via drill 0.5 pad 1.5)
  other vias: 41.75,15.22
N$137  (via drill 0.5 pad 1.5)
  other vias: 39.51,9.13
N$138  (via drill 0.5 pad 1.5)
  other vias: 27.12,9.08
N$139  (via drill 0.5 pad 1.5)
  other vias: 47.2,10.88
N$140  (via drill 0.5 pad 1.5)
  other vias: 47.15,20.92
N$141  (via drill 0.5 pad 1.5)
  other vias: 50.3,51.78
N$142  (via drill 0.5 pad 1.5)
  other vias: 60.55,51.9
N$143  (via drill 0.5 pad 1.5)
  other vias: 52.57,58.8
N$144  (via drill 0.5 pad 1.5)
  other vias: 55.09,58.62
N$145  (via drill 0.5 pad 1.5)
  other vias: 58.03,58.68
N$146  (via drill 0.5 pad 1.5)
  other vias: 79.55,78.17
N$147  (via drill 0.5 pad 1.5)
  other vias: 79.61,67.91
N$148  (via drill 0.5 pad 1.5)
  other vias: 60.53,69.94
N$149  (via drill 0.5 pad 1.5)
  other vias: 112.21,63.06
N$150
  Bottom 1.016: D7.C 47.12,20.88 40.01,20.88 K3.1 39.12,21.77 39.12,24.43 35.56,27.99 35.56,28.88 38.23,31.55 42.67,31.55 47.12,35.99 47.12,39.55
N$152
  Bottom 1.016: D4.C 61.34,69.77 71.12,69.77 79.12,77.77 C1.+
N$158  (1 unrouted)
N$159  (2 unrouted)
VDD  (via drill 1.78 pad 0.38, 1.78 pad 0.65)  (3 unrouted)
  Top 1.016: v89.64,25.81 93.81,21.63 | 93.81,21.63 101.42,14.02 101.42,7.14 93.37,7.14 93.37,11.79 93.45,11.86 v93.45,12.14 | v72.36,21.28 93.47,21.28 93.81,21.63 | v63.52,62.23 63.2,61.9 62.28,61.9 62.28,53.49 v67.79,47.98 | v88.62,53.54 88.62,55.68 93.93,60.99 v97.97,60.99
  Bottom 1.016: 97.79,68 96.01,66.22 96.01,65.33 100.03,61.32 | 100.03,61.32 102.23,59.11 105.79,59.11 112.01,52.88 112.01,32.44 110.24,30.66 R6.1 | v89.64,25.81 89.53,25.81 89.2,26.14 89.1,26.14 88.34,26.9 U1.7 88.34,39.39 | v93.45,12.14 93.45,15.8 | 70.64,19.74 72.42,21.51 72.42,21.34 v72.36,21.28 | 88.34,39.39 93.42,44.47 U1.20 93.42,48.67 91.31,50.78 91.31,50.85 v88.62,53.54 | 88.34,41.44 88.34,39.39 | 88.34,41.44 88.08,41.71 | v63.52,62.23 66.62,59.13 C3.+ 65.38,58.72 | 98.75,61.7 98.68,61.7 v97.97,60.99 99.21,62.23 100.03,62.23 100.03,61.32 | 88.34,41.44 81.17,41.44 80.57,42.04 71.78,42.04 67.67,46.15 67.67,47.95 67.77,47.95 v67.79,47.98
VSS  (via drill 1.78 pad 0.38)  (7 unrouted)
  Top 1.016: v112.22,63.04 111.96,62.79 111.91,62.79 106.86,57.73 94.79,57.73 94.79,57.15 v93.88,56.24 93.88,53.49 90.6,50.22 v88.01,50.22 | v100.76,24.79 104.88,24.79 v107.9,27.81
  Bottom 1.016: 98.68,65.33 105.79,65.33 108.46,62.66 | 108.46,62.66 113.79,57.33 113.79,28.04 | 113.79,28.04 113.79,24.43 110.24,20.88 R6.3 109.35,19.99 105.79,16.43 96.01,16.43 | 54.23,36.88 54.23,48.44 50.67,51.99 D5.A | 67.56,26.21 67.56,16.43 59.56,16.43 58.67,17.32 55.12,17.32 T1.3 54.23,18.21 38.23,18.21 32,24.43 16.89,24.43 9.78,31.55 9.78,38.66 12.45,41.33 12.45,46.66 | 67.56,26.21 67.56,27.1 SL2.1 | 55.12,35.99 57.78,35.99 67.56,26.21 | U1.8 90.68,38.66 90.68,28.88 93.05,26.51 C6.2 98.06,26.26 98.09,26.09 C5.2 99.34,24.92 100.43,24.92 100.56,24.79 v100.76,24.79 | 85.34,52.88 v88.01,50.22 88.01,46.64 88.29,46.52 U1.22 | v93.88,56.24 93.93,56.18 94.06,56.18 95.71,54.53 | v112.22,63.04 111.84,62.66 108.46,62.66 | v107.9,27.81 108.13,28.04 113.79,28.04

### Text on the board
Top: IMart | SLIIT